# EAGLE design CFO_nanoproto_rev3 (EAGLE 9.6.2)
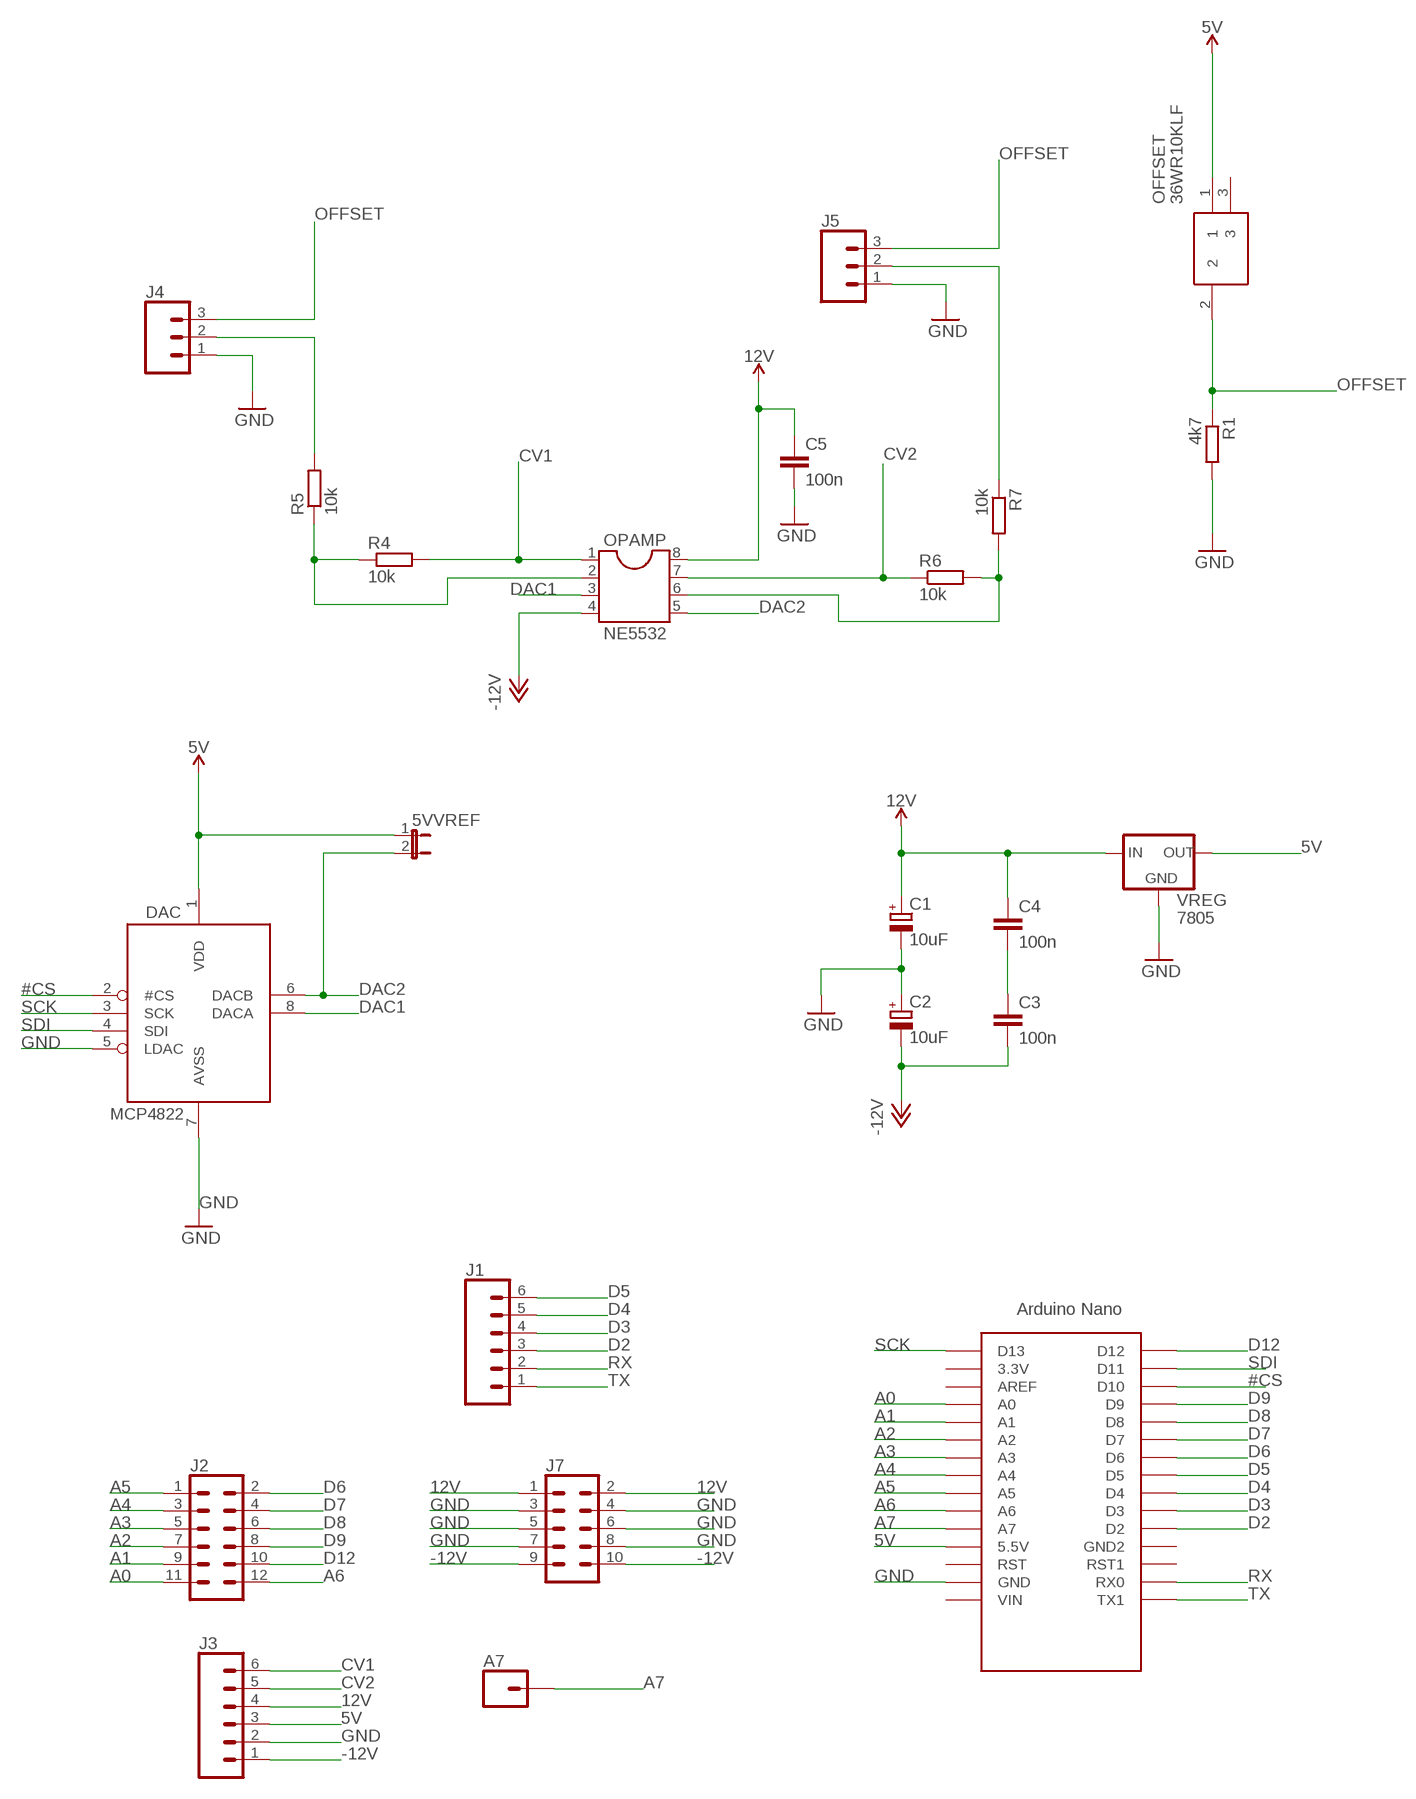
[diagram p0: schematic, sheet 1]

## Parts
5VVREF  JUMPER-2PTH  [1X02]
A7  CONN_01  [1X01]
C1  10uF  CPOL-EUE2-5  [E2-5]
C2  10uF  CPOL-EUE2-5  [E2-5]
C3  100n  C-EU050-025X075  [C050-025X075]
C4  100n  C-EU050-025X075  [C050-025X075]
C5  100n  C-EU050-025X075  [C050-025X075]
DAC  MCP4822  [DIL08]
J1  CONN_06NO_SILK_NO_POP  [1X06_NO_SILK]
J2  2X6 FEMALE  CONN_06X2PTH_FEMALE  [2X6]
J3  CONN_06NO_SILK_NO_POP  [1X06_NO_SILK]
J4  CONN_03  [1X03]
J5  CONN_03  [1X03]
J7  EURO_CONN_05X2SHD  [2X5-SHROUDED]
OFFSET  36WR10KLF  [36WR10KLF]
OPAMP  NE5532  DIL8  [DIL08]
R1  4k7  R-EU_0207/10  [0207/10]
R4  10k  R-EU_0207/10  [0207/10]
R5  10k  R-EU_0207/10  [0207/10]
R6  10k  R-EU_0207/10  [0207/10]
R7  10k  R-EU_0207/10  [0207/10]
U$2  NANO  [NANO]
VREG  7805  V_REG_78XXNOHOLE  [78XXL_NOHOLE]

## Nets
5V: 5VVREF.1 DAC.1(VDD) J3.3 OFFSET.1 U$2.5V(5.5V) VREG.OUT
12V: C1.+ C4.1 C5.1 J3.4 J7.1 J7.2 OPAMP.8 VREG.IN
#CS: DAC.2(#CS) U$2.D10
-12V: C2.- C3.2 J3.1 J7.9 J7.10 OPAMP.4
A0: J2.11 U$2.A0
A1: J2.9 U$2.A1
A2: J2.7 U$2.A2
A3: J2.5 U$2.A3
A4: J2.3 U$2.A4
A5: J2.1 U$2.A5
A6: J2.12 U$2.A6
A7: A7.1 U$2.A7
CV1: J3.6 OPAMP.1 R4.2
CV2: J3.5 OPAMP.7 R6.1
D2: J1.3 U$2.D2
D3: J1.4 U$2.D3
D4: J1.5 U$2.D4
D5: J1.6 U$2.D5
D6: J2.2 U$2.D6
D7: J2.4 U$2.D7
D8: J2.6 U$2.D8
D9: J2.8 U$2.D9
D12: J2.10 U$2.D12
DAC1: DAC.8(DACA) OPAMP.3
DAC2: 5VVREF.2 DAC.6(DACB) OPAMP.5
GND: C1.- C2.+ C5.2 DAC.5(LDAC) DAC.7(AVSS) J3.2 J4.1 J5.1 J7.3 J7.4 J7.5 J7.6 J7.7 J7.8 R1.2 U$2.GND VREG.GND
N$1: C3.1 C4.2
N$2: OPAMP.6 R6.2 R7.2
N$3: J4.2 R5.2
N$4: OPAMP.2 R4.1 R5.1
N$5: J5.2 R7.1
OFFSET: J4.3 J5.3 OFFSET.2 R1.1
RX: J1.2 U$2.RX0
SCK: DAC.3(SCK) U$2.D13
SDI: DAC.4(SDI) U$2.D11
TX: J1.1 U$2.TX1
Unconnected: OFFSET.3 U$2.3.3V U$2.AREF U$2.GND1(GND2) U$2.RST U$2.RST1 U$2.VIN

## Library data of the parts
5VVREF = USER:JUMPER-2: Jumper Basic 0.1" spaced jumper. Use with breakaway headers.
A7 = SparkFun-Connectors:CONN_01: Single connection point. Often used as Generic Header-pin footprint for 0.1 inch spaced/style header connections On any of the 0.1 inch spaced packages, you can populate with these: Break Away Headers - Straight <https://www.sparkfun.com/products/116> (PRT-00116) Break Away Male Headers - Right Angle <https://www.sparkfun.com/products/553> (PRT-00553) Female Headers <https://www.sparkfun.com/products/115> (PRT-00115) Break Away Headers - Machine Pin <https://www.sparkfun.com/products/117> (PRT-00117) Break Away Female Headers - Swiss Machine Pin <https://www.sparkfun.com/products/743> (PRT-00743) This device is also useful as a general connection point to wire up your design to another part of your project. Our various solder wires solder well into these plated through hole pads. Hook-Up Wire - Assortment (Stranded, 22 AWG) <https://www.sparkfun.com/products/11375> (PRT-11375) Hook-Up Wire - Assortment (Solid Core, 22 AWG) <https://www.sparkfun.com/products/11367> (PRT-11367) View the entire wire category on our website here <https://www.sparkfun.com/categories/141> Special notes: SMTSO-256-ET is a "flush mount" nut for a 4-40 screw. We mostly use this on specialty testbeds; it is a nice way to connect hardware to your PCB at an adjustable hieght. Also note, the SNAP packages are for using a snappable style connector. We sell a baggie of snaps and they are also used on two LilyPad designs: Snap Assortment - 30 pack (male and female) <https://www.sparkfun.com/products/11347> (DEV-11347) LilyPad Arduino SimpleSnap <https://www.sparkfun.com/products/10941> (DEV-10941) LilyPad SimpleSnap Protoboard <https://www.sparkfun.com/products/10940> (DEV-10940)
C1 C2 = rcl:CPOL-EU: POLARIZED CAPACITOR, European symbol; SPICEPREFIX: C
C3-C5 = rcl:C-EU: CAPACITOR, European symbol; SPICEPREFIX: C
DAC = adafruit_edit:MCP4822
J1 J3 = SparkFun-Connectors:CONN_06: Multi connection point. Often used as Generic Header-pin footprint for 0.1 inch spaced/style header connections On any of the 0.1 inch spaced packages, you can populate with these: Break Away Headers - Straight <https://www.sparkfun.com/products/116> (PRT-00116) Break Away Male Headers - Right Angle <https://www.sparkfun.com/products/553> (PRT-00553) Female Headers <https://www.sparkfun.com/products/115> (PRT-00115) Break Away Headers - Machine Pin <https://www.sparkfun.com/products/117> (PRT-00117) Break Away Female Headers - Swiss Machine Pin <https://www.sparkfun.com/products/743> (PRT-00743) Arduino Stackable Header - 6 Pin <https://www.sparkfun.com/products/9280> (PRT-09280) For SCREWTERMINALS and SPRING TERMINALS visit here: Screw Terimnals on SparkFun.com <https://www.sparkfun.com/search/results?term=Screw+Terminals> (5mm/3.5mm/2.54mm spacing) This device is also useful as a general connection point to wire up your design to another part of your project. Our various solder wires solder well into these plated through hole pads. Hook-Up Wire - Assortment (Stranded, 22 AWG) <https://www.sparkfun.com/products/11375> (PRT-11375) Hook-Up Wire - Assortment (Solid Core, 22 AWG) <https://www.sparkfun.com/products/11367> (PRT-11367) View the entire wire category on our website here <https://www.sparkfun.com/categories/141>
J2 = SparkFun-Connectors:CONN_06X2: Multi connection point. Often used as Generic Header-pin footprint for 0.1 inch spaced/style header connections On any of the 0.1 inch spaced packages, you can populate with these: Break Away Headers - Straight <https://www.sparkfun.com/products/116> (PRT-00116) Break Away Male Headers - Right Angle <https://www.sparkfun.com/products/553> (PRT-00553) Female Headers <https://www.sparkfun.com/products/115> (PRT-00115) Break Away Headers - Machine Pin <https://www.sparkfun.com/products/117> (PRT-00117) Break Away Female Headers - Swiss Machine Pin <https://www.sparkfun.com/products/743> (PRT-00743); PROD_ID: CONN-12423
J4 J5 = SparkFun-Connectors:CONN_03: Multi connection point. Often used as Generic Header-pin footprint for 0.1 inch spaced/style header connections On any of the 0.1 inch spaced packages, you can populate with these: Break Away Headers - Straight <https://www.sparkfun.com/products/116> (PRT-00116) Break Away Male Headers - Right Angle <https://www.sparkfun.com/products/553> (PRT-00553) Female Headers <https://www.sparkfun.com/products/115> (PRT-00115) Break Away Headers - Machine Pin <https://www.sparkfun.com/products/117> (PRT-00117) Break Away Female Headers - Swiss Machine Pin <https://www.sparkfun.com/products/743> (PRT-00743) Stackable Header - 3 Pin (Female, 0.1") <https://www.sparkfun.com/products/13875> (PRT-13875) For SCREWTERMINALS and SPRING TERMINALS visit here: Screw Terimnals on SparkFun.com <https://www.sparkfun.com/search/results?term=Screw+Terminals> (5mm/3.5mm/2.54mm spacing) This device is also useful as a general connection point to wire up your design to another part of your project. Our various solder wires solder well into these plated through hole pads. Hook-Up Wire - Assortment (Stranded, 22 AWG) <https://www.sparkfun.com/products/11375> (PRT-11375) Hook-Up Wire - Assortment (Solid Core, 22 AWG) <https://www.sparkfun.com/products/11367> (PRT-11367) View the entire wire category on our website here <https://www.sparkfun.com/categories/141> Special notes: Molex polarized connector foot print use with SKU : PRT-08232 with associated crimp pins and housings.
J7 = SparkFun-Connectors:EURO_CONN_05X2: Multi connection point. Often used as Generic Header-pin footprint for 0.1 inch spaced/style header connections For AVR SPI programming port, see special device with nice symbol: "AVR_SPI_PROG_5x2.dev" You can populate with any combo of single row headers, but if you'd like an exact match, check these: 2x5 AVR ICSP Male Header <https://www.sparkfun.com/products/778> (PRT-00778) 2x5 Pin Shrouded Header <https://www.sparkfun.com/products/8506> (PRT-08506) On any of the 0.1 inch spaced packages, you can populate with these: Break Away Headers - Straight <https://www.sparkfun.com/products/116> (PRT-00116) Break Away Male Headers - Right Angle <https://www.sparkfun.com/products/553> (PRT-00553) Female Headers <https://www.sparkfun.com/products/115> (PRT-00115) Break Away Headers - Machine Pin <https://www.sparkfun.com/products/117> (PRT-00117) Break Away Female Headers - Swiss Machine Pin <https://www.sparkfun.com/products/743> (PRT-00743) Special note: the shrouded connector mates well with our 5x2 ribbon cables: 2x5 Pin IDC Ribbon Cable <https://www.sparkfun.com/products/8535> (PRT-08535); PROD_ID: CONN-08671; SF_ID: PRT-08506
OFFSET = 36WR10KLF:36WR10KLF: Trimmer Resistors - Through Hole 10K 6MM ST SIDE ADJ Source: Datasheet <https://www.ttelectronics.com/TTElectronics/media/ProductFiles/Trimmers/Datasheets/36.pdf>; DESCRIPTION: Trimmer Resistors - Through Hole 10K 6MM ST SIDE ADJ; HEIGHT: 8.4mm; MANUFACTURER_NAME: BI Technologies; MANUFACTURER_PART_NUMBER: 36WR10KLF; MOUSER_PART_NUMBER: 858-36WR10KLF; MOUSER_PRICE-STOCK: https://www.mouser.co.uk/ProductDetail/BI-Technologies-TT-Electronics/36WR10KLF/?qs=QwqSU04NtKmpwRQ%2F%252BscNrA%3D%3D
OPAMP = ic-package:DIL8: Dual In Line / Socket
R1 R4-R7 = rcl:R-EU_: RESISTOR, European symbol; SPICEPREFIX: R
U$2 = CFO:NANO: Arduino Nano
VREG = SparkFun-IC-Power_edits:V_REG_78XX: Voltage Regulator Standard 78xx regulator. IGO (Input Ground Output). Spark Fun Electronics SKU : COM-00107

## Board
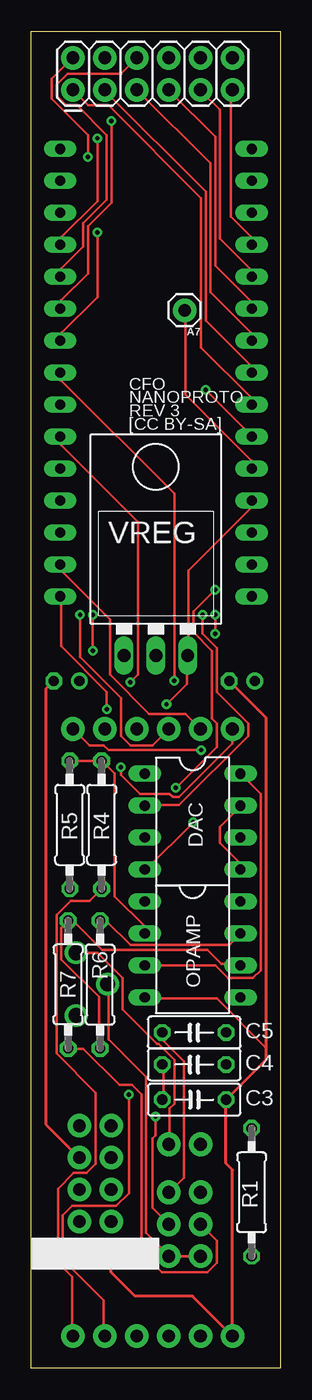
[diagram p1: board, top side]
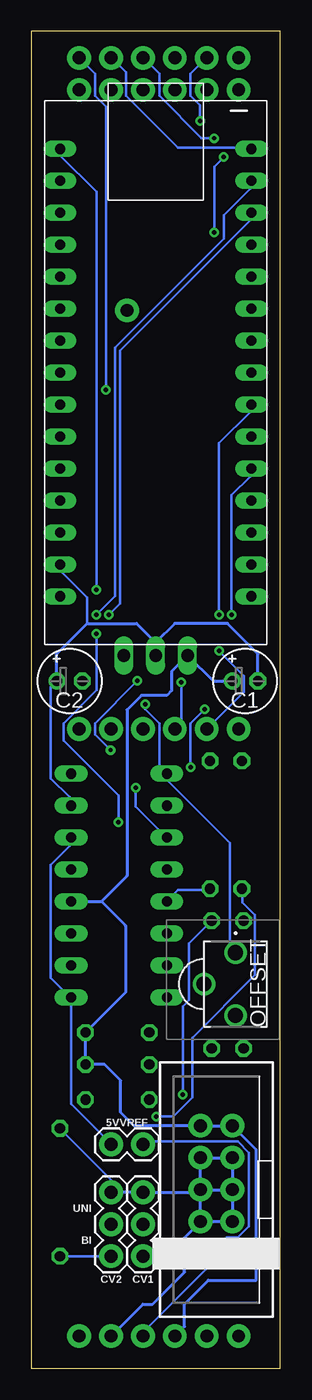
[diagram p2: board, bottom side, seen from below]

Size 19.8 x 106.24 mm. Coordinates in mm from the lower left corner, seen from the top.
Outline: 19.8,0 0,0 0,106.24 19.8,106.24 19.8,0
Copper layers (1*16): Top 0.035mm / dielectric 1.5mm / Bottom 0.035mm
Design rules "default *": minimum track width 8mil, minimum drill 0.35mm, track to track 6mil, track to pad 6mil, pad to pad 6mil, via to via 6mil, smd to smd 6mil, copper to edge 40mil, drill to drill 6mil, minimum pad ring 10mil, minimum via ring 8mil, stop-mask expansion 4mil, vias tented up to drill 0mil, thermal gap 10mil

### Footprints (pad centres in the part's own frame; a part is rotated, then mirrored left to right if it is on the bottom)
1X02 = drill 1.016 pad 1.88: 1 0,0; 2 2.54,0
1X01 = drill 1.016 pad 1.88: 1 0,0
E2-5 = drill 0.813 pad 1.27: + -1.016,0 | drill 0.813 pad 1.27 octagon: - 1.016,0
C050-025X075 = drill 0.813 octagon: 1 -2.54,0; 2 2.54,0
DIL08 = drill 0.813 long: 1 -3.81,-3.81; 2 -1.27,-3.81; 3 1.27,-3.81; 4 3.81,-3.81; 5 3.81,3.81; 6 1.27,3.81; 7 -1.27,3.81; 8 -3.81,3.81
1X06_NO_SILK = drill 1.016 pad 1.88: 1 0,0; 2 2.54,0; 3 5.08,0; 4 7.62,0; 5 10.16,0; 6 12.7,0
2X6 = drill 1.016 pad 1.88: 1 0,0; 2 0,2.54; 3 2.54,0; 4 2.54,2.54; 5 5.08,0; 6 5.08,2.54; 7 7.62,0; 8 7.62,2.54; 9 10.16,0; 10 10.16,2.54; 11 12.7,0; 12 12.7,2.54
1X03 = drill 1.016 pad 1.88: 1 0,0; 2 2.54,0; 3 5.08,0
2X5-SHROUDED = drill 1.016 pad 1.88: 1 -1.27,5.08; 2 1.27,5.08; 3 -1.27,2.54; 4 1.27,2.54; 5 -1.27,0; 6 1.27,0; 7 -1.27,-2.54; 8 1.27,-2.54; 9 -1.27,-5.08; 10 1.27,-5.08
36WR10KLF = drill 1.2 pad 1.8: 1 0,0; 2 2.5,-2.5; 3 5,0
0207/10 = drill 0.813 octagon: 1 -5.08,0; 2 5.08,0
NANO = drill 0.8 long: 3.3V -7.62,15.24; 5V -7.62,-10.16; A0 -7.62,10.16; A1 -7.62,7.62; A2 -7.62,5.08; A3 -7.62,2.54; A4 -7.62,0; A5 -7.62,-2.54; A6 -7.62,-5.08; A7 -7.62,-7.62; AREF -7.62,12.7; D2 7.62,-7.62; D3 7.62,-5.08; D4 7.62,-2.54; D5 7.62,0; D6 7.62,2.54; D7 7.62,5.08; D8 7.62,7.62; D9 7.62,10.16; D10 7.62,12.7; D11 7.62,15.24; D12 7.62,17.78; D13 -7.62,17.78; GND -7.62,-15.24; GND1 7.62,-10.16; RST -7.62,-12.7; RST1 7.62,-12.7; RX0 7.62,-15.24; TX1 7.62,-17.78; VIN -7.62,-17.78
78XXL_NOHOLE = drill 1.016 long: GND 0,-3.81; IN -2.54,-3.81; OUT 2.54,-3.81

### Placement (x,y rotation side)
5VVREF  10.92,17.78 180 bottom
A7  12.19,84.07 180 top
C1  2.79,54.61 0 bottom
C2  16.76,54.61 0 bottom
C3  12.95,21.34 0 top
C4  12.95,24.13 180 top
C5  12.95,26.67 180 top
DAC  12.83,43.43 270 top
J1  16,50.8 180 top
J2  3.3,101.6 0 top
J3  16,2.54 180 top
J4  10.92,13.97 270 bottom
J5  13.46,13.97 270 bottom
J7  5.08,14.18 0 bottom
OFFSET  3.56,33.02 270 bottom
OPAMP  12.83,33.27 270 top
R1  17.53,13.97 90 top
R4  5.59,43.18 270 top
R5  3.05,43.18 270 top
R6  5.46,30.48 270 top
R7  2.92,30.48 90 top
U$2  9.91,79.12 0 bottom
VREG  9.91,60.45 0 top

### Tracks (layer width: path | path; a pad name or v marks a point on that pad's centre or on a via)
5V  (via drill 0.35)
  Top 0.203: U$2.5V 17.5,68.88 17.5,68.38 12.5,63.38 12.5,56.75 VREG.OUT 12.38,56.62 12.38,54.38 v10.75,52.75 | 5VVREF.1 11,17.88 11,20.62 11.38,21 11.38,24.5 10.12,25.75 10,25.75 7.25,28.5 7.25,31 5.25,33 3.62,33 OFFSET.1
  Bottom 0.203: J3.3 10.88,2.62 10.88,2.88 5.12,8.62 5.12,9.5 4.25,10.38 3.38,10.38 2.5,11.25 2.5,17.12 3.38,18 10.75,18 10.88,17.88 5VVREF.1 | OFFSET.1 3.62,33.12 4,33.5 4,41.75 9,46.75 9,47.12 DAC.1 9.12,47.25 9.62,47.75 9.62,51.25 10.75,52.38 v10.75,52.75
12V
  Bottom 0.254: J3.4 7.62,3.3 7.62,5.08 5.71,6.99 1.91,6.99 1.91,17.36 J7.2 J7.1 11.64,19.26 12.7,20.32 12.7,22.86 13.97,24.13 C4.1 C5.1 12.32,29.84 12.32,35.18 14.22,37.08 | C1.+ 5.33,54.61 VREG.IN 8.64,55.37 8.64,53.85 9.02,53.47 11.05,53.47 12.19,52.32 12.19,39.12 14.22,37.08 | OPAMP.8 14.22,37.08
#CS  (via drill 0.35)
  Top 0.203: v13.62,59.88 13.62,58.38 14.75,57.25 14.75,53.75 17.25,51.25 17.25,50.25 11.75,44.75 9.12,44.75 DAC.2
  Bottom 0.203: v13.62,59.88 12.75,60.75 12.75,80.88 2.38,91.25 2.38,91.75 U$2.D10
-12V
  Top 0.203: OPAMP.4 9.12,29.38 14.75,29.38 18.62,25.5 18.66,25.5
  Top 0.254: J7.10 J7.9 6.35,7.62 8.26,5.71 12.83,5.71 J3.1 16,15.75 15.49,16.26 C3.2 18.66,24.5 18.66,25.5 18.66,51.7 C2.-
A0
  Top 0.203: U$2.A0 17.5,89.38 17.5,89.88 15.88,91.5 15.88,101.38 16,101.5 J2.11
A1
  Top 0.203: U$2.A1 17.5,86.75 17.5,87.25 15,89.75 15,100 13.5,101.5 J2.9
A2
  Top 0.203: U$2.A2 17.5,84.25 17.5,84.75 14.62,87.62 14.62,97.88 11,101.5 J2.7
A3
  Top 0.203: U$2.A3 17.5,81.75 17.5,82.25 14.25,85.5 14.25,95.75 8.5,101.5 J2.5
A4
  Top 0.203: U$2.A4 17.5,79.12 17.5,79.62 13.88,83.25 13.88,93.5 5.88,101.5 J2.3
A5
  Top 0.203: U$2.A5 17.5,76.62 17.5,77.12 13.5,81.12 13.5,93 6.12,100.38 4.5,100.38 3.38,101.5 J2.1
A6  (via drill 0.35)
  Top 0.203: v13.88,77.75 17.5,74.12 U$2.A6
  Bottom 0.203: v13.88,77.75 13.88,100.25 14.75,101.12 14.75,102.88 16,104.12 J2.12
A7
  Top 0.203: U$2.A7 17.5,71.62 17.5,72.12 12.25,77.38 12.25,84 A7.1
CV1
  Top 0.203: J3.6 3.25,2.62 3.25,7.25 2.12,8.38 2.12,14.25 3.38,15.5 4.38,15.5 5.12,16.25 5.12,21.88 2,25 2,36 3.12,37.12 4.62,37.12 5.5,38 R4.2
  Bottom 0.203: R4.2 5.62,38 8.12,38 9,37.12 OPAMP.1
CV2  (via drill 0.35)
  Top 0.203: R6.1 5.5,35.5 6,35.5 7.88,33.62 15.75,33.62 16.62,34.5 OPAMP.7 | v7.75,21.75 7.75,13.88 6.75,12.88 3.25,12.88 2.5,12.12 2.5,8.62 5.75,5.38 5.75,2.62 J3.5
  Bottom 0.203: v7.75,21.75 7.75,28.75 7.25,29.25 7.25,33.75 5.5,35.5 R6.1
D2  (via drill 0.35)
  Top 0.203: v3.88,59.88 3.88,56.5 7.12,53.25 7.12,50.25 7.88,49.5 9.62,49.5 10.88,50.75 J1.3
  Bottom 0.203: v3.88,59.88 3.88,69.38 2.38,70.88 2.38,71.5 U$2.D2
D3  (via drill 0.35)
  Top 0.203: v7.88,54.5 8.5,55.12 8.5,67.25 2.38,73.38 2.38,74 U$2.D3
  Bottom 0.203: v7.88,54.5 7.88,51.38 8.38,50.88 J1.4
D4  (via drill 0.35)
  Top 0.203: v4.88,57 v4.88,59.88
  Bottom 0.203: v4.88,59.88 4.88,73.5 2.38,76 2.38,76.5 U$2.D4 | v4.88,57 2.88,55 2.88,53.75 5.75,50.88 J1.5
D5  (via drill 0.35)
  Top 0.203: v11.38,54.62 11.38,69.5 2.38,78.5 2.38,79 U$2.D5 | v13.5,49.12 6.12,49.12 5.75,49.5 4.62,49.5 3.38,50.75 J1.6
  Bottom 0.203: v11.38,54.62 14.75,51.25 14.75,50.38 v13.5,49.12
D6  (via drill 0.35)
  Top 0.203: v5.25,90.25 5.25,85.12 2.38,82.25 2.38,81.75 U$2.D6 | v4.5,96.25 4.5,98 1.62,100.88 1.62,102.5 3.25,104.12 J2.2
  Bottom 0.203: v5.25,90.25 5.25,95.5 v4.5,96.25
D7  (via drill 0.35)
  Top 0.203: v6.38,99.12 6.38,92.62 4.5,90.75 4.5,87 2.38,84.88 2.38,84.25 U$2.D7
  Bottom 0.203: v6.38,99.12 6.38,100.38 7.12,101.12 7.12,102.88 5.88,104.12 J2.4
D8
  Top 0.203: U$2.D8 2.38,86.75 2.38,87.38 4.12,89.12 4.12,91 6,92.88 6,98 3.62,100.38 2.75,100.38 2,101.12 2,102 2.88,102.88 7.12,102.88 8.38,104.12 J2.6
D9  (via drill 0.35)
  Top 0.203: v5.25,97.75 5.25,92.75 2.38,89.88 2.38,89.38 U$2.D9
  Bottom 0.203: v5.25,97.75 6.25,97.75 9.62,101.12 9.62,102.88 10.88,104.12 J2.8
D12
  Bottom 0.203: U$2.D12 2.38,97 8.12,97 12.25,101.12 12.25,103 13.38,104.12 J2.10
DAC1
  Top 0.203: OPAMP.3 9.12,32 14.62,32 15.62,31 17.62,31 18.25,31.62 18.25,45.62 16.75,47.12 DAC.8
DAC2
  Bottom 0.203: 5VVREF.2 13.5,17.88 16.62,21 16.62,29.38 OPAMP.5 16.75,29.5 18.25,31 18.25,40 16.75,41.5 16.75,42.12 DAC.6
GND
  Top 0.203: DAC.5 16.62,39.62 16.62,40.12 15,41.75 15,43 16.62,44.62 DAC.7 | C5.2 10.5,26.62 10.5,26 12.12,24.38 12.12,15.12 11,14 J4.1
  Top 0.254: C1.- 1.14,53.98 1.14,19.39 J7.4
  Bottom 0.203: U$2.GND 17.5,63.88 17.5,63.38 15.38,61.25 15.38,59.25 15.37,59.18 | R1.2 17.5,19 12.5,14 12.5,13.97 | DAC.7 16.75,44.75 16.75,45.38 18.25,46.88 18.25,54.12 17.88,54.5 C2.+
  Bottom 0.254: J7.6 J7.4 J7.3 J7.5 | J7.6 J7.8 J7.7 | J7.7 J7.5 | J7.5 J7.6 | J7.5 6.56,13.97 J4.1 12.5,13.97 J5.1 | J3.2 10.92,5.08 10.16,5.08 7.62,7.62 7.62,10.37 J7.7 | C1.- 1.78,56.77 4.19,59.18 8.38,59.18 9.91,57.66 | 9.91,57.66 VREG.GND | C2.+ 17.78,56.77 15.37,59.18 11.43,59.18 9.91,57.66
N$1
  Top 0.203: C3.1 10.5,21.38 10.5,24.12 C4.2
N$2
  Top 0.203: R6.2 5.38,25.5 5.38,29.5 2.38,32.5 2.38,35 2.88,35.5 R7.2 3,35.5 3.38,35.5 5.62,33.25 14,33.25 15.12,32.12 16.62,32.12 OPAMP.6
N$3  (via drill 0.35)
  Top 0.203: v9.88,20 9.88,18.5 9.62,18.25 9.62,12.75 10.88,11.5 J4.2
  Bottom 0.203: v9.88,20 8.5,20 7,21.5 7,26.25 2,31.25 2,36 3,37 3,38 R5.2
N$4
  Top 0.203: OPAMP.2 9,34.62 9,35.12 6.62,37.5 6.62,47.25 5.62,48.25 R4.1 5.5,48.25 3.12,48.25 R5.1
N$5
  Top 0.203: R7.1 3,25.38 4.12,25.38 7,22.5 8,22.5 8.75,21.75 8.75,9.25 10.38,7.62 14,7.62 14.75,8.38 14.75,10.12 13.5,11.38 J5.2
OFFSET
  Top 0.203: OFFSET.2 6.12,30.5 6.12,26.12 9.12,23.12 9.12,10.75 10.88,9 J4.3 11,8.88 13.38,8.88 J5.3
  Bottom 0.203: R1.1 17.5,8.88 13.5,8.88 J5.3
RX
  Top 0.203: U$2.RX0 2.38,63.88 2.38,63.38 6.25,59.5 6.25,55.12 9.38,52 12.25,52 13.38,50.88 J1.2
SCK  (via drill 0.35)
  Top 0.203: v14.62,61.88 12.88,60.12 12.88,58.5 14.38,57 14.38,51.62 14.75,51.25 14.75,49.38 v11.5,46.12
  Bottom 0.203: v14.62,61.88 14.62,93.5 17.5,96.38 17.5,96.88 U$2.D13 | v11.5,46.12 11.5,44.62 9.12,42.25 DAC.3
SDI  (via drill 0.35)
  Top 0.203: v14.62,58.38 v14.62,59.88 | v12.88,43.38 9.12,39.62 DAC.4
  Bottom 0.203: v14.62,59.88 13.12,61.38 13.12,81.12 4.5,89.75 4.5,91.62 2.38,93.75 2.38,94.25 U$2.D11 | v14.62,58.38 14.62,53.88 17.25,51.25 17.25,49.88 12.88,45.5 v12.88,43.38
TX  (via drill 0.35)
  Top 0.203: v6,52.38 6,53.75 2.38,57.38 2.38,61.25 U$2.TX1 | v7.12,47.75 7.12,47.12 8.62,45.62 11,45.62 11.25,45.38 11.75,45.38 16,49.62 16,50.75 J1.1
  Bottom 0.203: v6,52.38 7.12,51.25 v7.12,47.75

### Text on the board
tNames: CFO / NANOPROTO / REV 3 / [CC BY-SA] | DAC
bNames: UNI | BI | CV1 | CV2